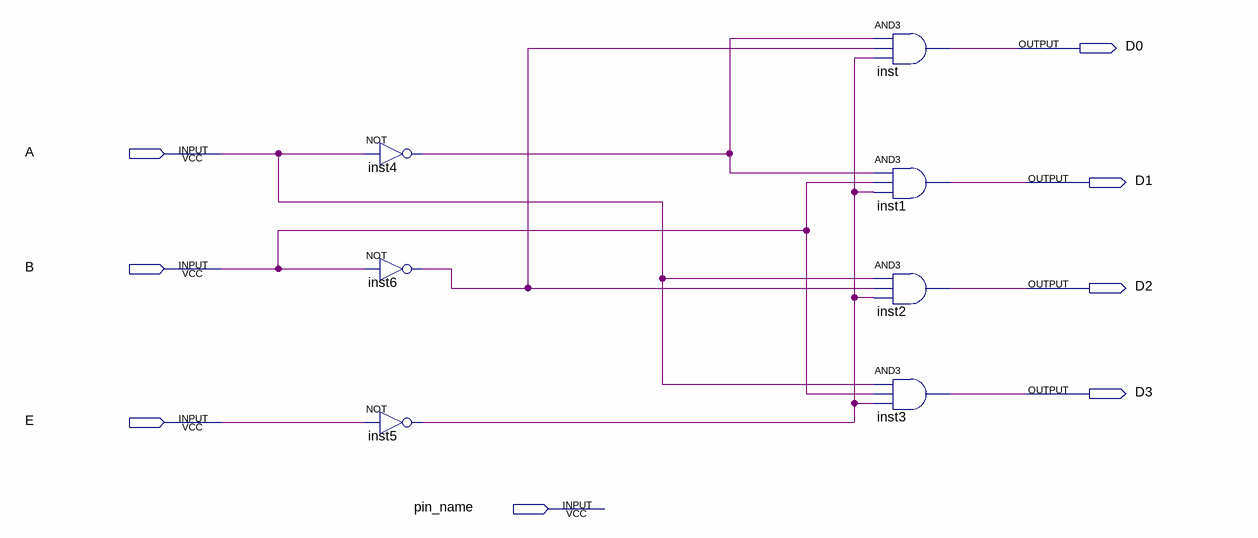
[diagram p0: schematic sheet]
// Quartus schematic BasicCircuitDesign.bdf as structural Verilog: 7 symbols, 8 pins
module BasicCircuitDesign (
  input  A,
  input  B,
  input  E,
  input  pin_name,
  output D0,
  output D1,
  output D2,
  output D3
);

  wire inst4_out, inst5_out, inst6_out;

  not inst4 (inst4_out, A);
  not inst6 (inst6_out, B);
  not inst5 (inst5_out, E);
  and inst (D0, inst4_out, inst6_out, inst5_out);
  and inst1 (D1, inst4_out, B, inst5_out);
  and inst2 (D2, A, inst6_out, inst5_out);
  and inst3 (D3, A, B, inst5_out);
endmodule
